# EAGLE schematic MotorControllerV7_HBridge2 (EAGLE 7.1.0)
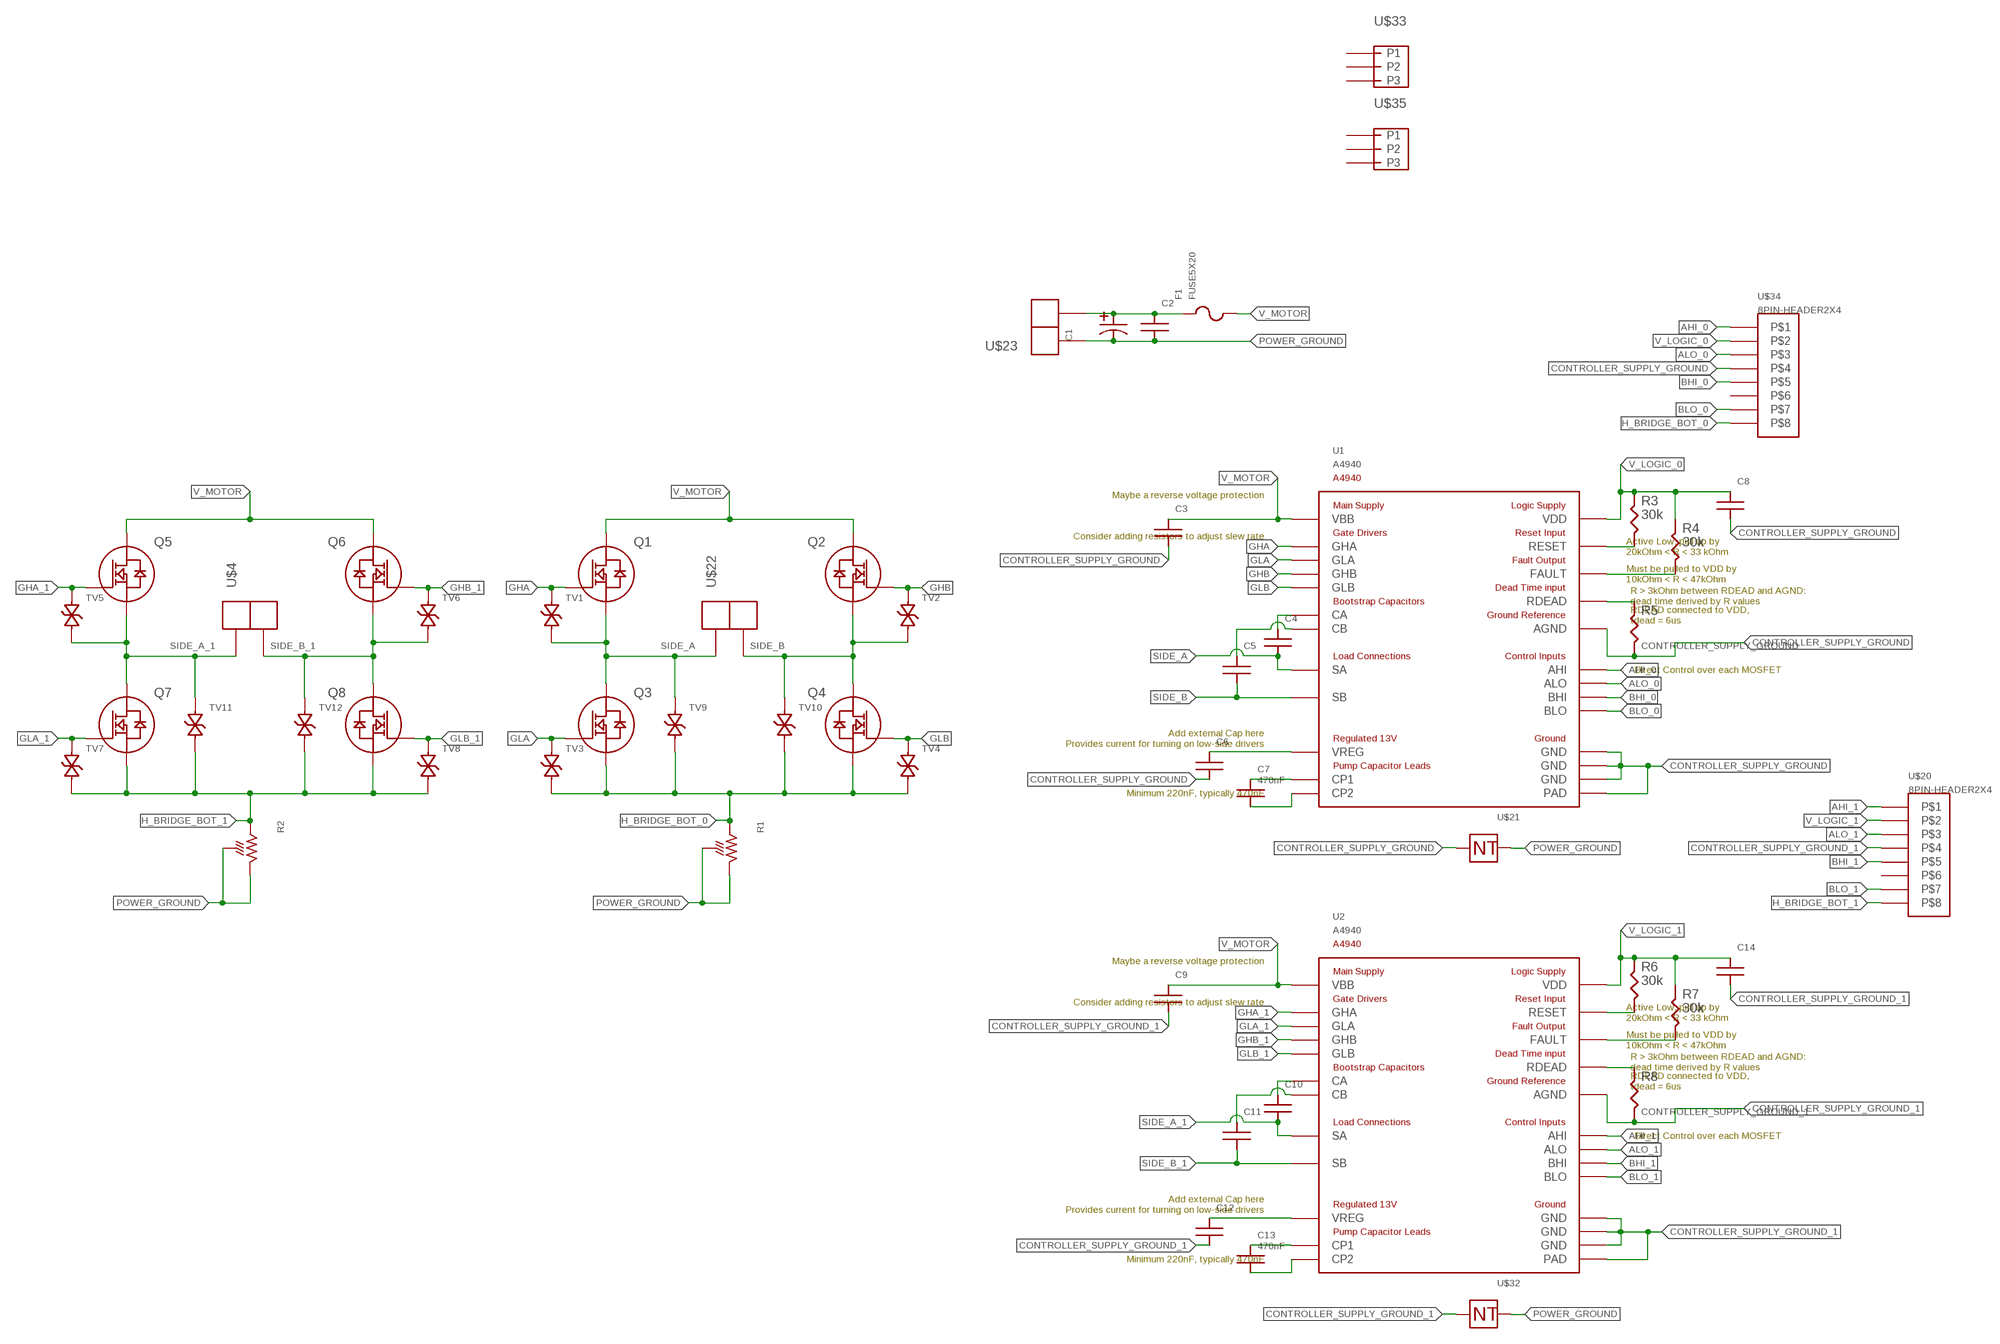
[diagram p0: schematic, sheet 1]

## Parts
C1  CAPACITORESK_H4  [ESK_H4_CAPACITOR]
C2  CAPACITOR-UNPOLARIZED0805  [0805_STACKPOLERESISTOR]
C3  CAPACITOR-UNPOLARIZED0805  [0805_STACKPOLERESISTOR]
C4  CAPACITOR-UNPOLARIZED0805  [0805_STACKPOLERESISTOR]
C5  CAPACITOR-UNPOLARIZED0805  [0805_STACKPOLERESISTOR]
C6  CAPACITOR-UNPOLARIZED0805  [0805_STACKPOLERESISTOR]
C7  470nF  CAPACITOR-UNPOLARIZED0805  [0805_STACKPOLERESISTOR]
C8  CAPACITOR-UNPOLARIZED0805  [0805_STACKPOLERESISTOR]
C9  CAPACITOR-UNPOLARIZED0805  [0805_STACKPOLERESISTOR]
C10  CAPACITOR-UNPOLARIZED0805  [0805_STACKPOLERESISTOR]
C11  CAPACITOR-UNPOLARIZED0805  [0805_STACKPOLERESISTOR]
C12  CAPACITOR-UNPOLARIZED0805  [0805_STACKPOLERESISTOR]
C13  470nF  CAPACITOR-UNPOLARIZED0805  [0805_STACKPOLERESISTOR]
C14  CAPACITOR-UNPOLARIZED0805  [0805_STACKPOLERESISTOR]
F1  FUSE5X20  [LITTLEFUSE_5X20_HOLDER]
Q1  NMOSSOT669  [SOT669]
Q2  NMOSSOT669  [SOT669]
Q3  NMOSSOT669  [SOT669]
Q4  NMOSSOT669  [SOT669]
Q5  NMOSSOT669  [SOT669]
Q6  NMOSSOT669  [SOT669]
Q7  NMOSSOT669  [SOT669]
Q8  NMOSSOT669  [SOT669]
R1  RESISTOR_HEATSUNK  [TO-252]
R2  RESISTOR_HEATSUNK  [TO-252]
R3  30k  RESISTOR  [0805_STACKPOLERESISTOR]
R4  30k  RESISTOR  [0805_STACKPOLERESISTOR]
R5  RESISTOR  [0805_STACKPOLERESISTOR]
R6  30k  RESISTOR  [0805_STACKPOLERESISTOR]
R7  30k  RESISTOR  [0805_STACKPOLERESISTOR]
R8  RESISTOR  [0805_STACKPOLERESISTOR]
TV1  TVS_BIDIRECTIONALDO-214AC  [DO-214AC]
TV2  TVS_BIDIRECTIONALDO-214AC  [DO-214AC]
TV3  TVS_BIDIRECTIONALDO-214AC  [DO-214AC]
TV4  TVS_BIDIRECTIONALDO-214AC  [DO-214AC]
TV5  TVS_BIDIRECTIONALDO-214AC  [DO-214AC]
TV6  TVS_BIDIRECTIONALDO-214AC  [DO-214AC]
TV7  TVS_BIDIRECTIONALDO-214AC  [DO-214AC]
TV8  TVS_BIDIRECTIONALDO-214AC  [DO-214AC]
TV9  TVS_BIDIRECTIONAL  [SMB]
TV10  TVS_BIDIRECTIONAL  [SMB]
TV11  TVS_BIDIRECTIONAL  [SMB]
TV12  TVS_BIDIRECTIONAL  [SMB]
U1  A4940  [LP_24-PIN_TSSOP]
U2  A4940  [LP_24-PIN_TSSOP]
U$4  2PIN-HEADERANDERSON_RIGHTANGLE  [ANDERSON_RIGHTANGLE_X2]
U$20  8PIN-HEADER2X4  [8PIN_2X4]
U$21  NET_TIE1MM  [NET_TIE]
U$22  2PIN-HEADERANDERSON_RIGHTANGLE  [ANDERSON_RIGHTANGLE_X2]
U$23  2PIN-HEADERANDERSON_RIGHTANGLE  [ANDERSON_RIGHTANGLE_X2]
U$32  NET_TIE1MM  [NET_TIE]
U$33  3PIN_HEADER  [3PIN_HEADER]
U$34  8PIN-HEADER2X4  [8PIN_2X4]
U$35  3PIN_HEADER  [3PIN_HEADER]

## Nets
AHI_0: U1.20(AHI) U$34.1
AHI_1: U2.20(AHI) U$20.1
ALO_0: U1.19(ALO) U$34.3
ALO_1: U2.19(ALO) U$20.3
BHI_0: U1.18(BHI) U$34.5
BHI_1: U2.18(BHI) U$20.5
BLO_0: U1.17(BLO) U$34.7
BLO_1: U2.17(BLO) U$20.7
CONTROLLER_SUPPLY_GROUND: C3.P$2 C6.P$2 C8.P$2 R5.P$2 U1.2(GND) U1.15(GND) U1.16(GND) U1.22(AGND) U1.PAD U$21.1 U$34.4
CONTROLLER_SUPPLY_GROUND_1: C9.P$2 C12.P$2 C14.P$2 R8.P$2 U2.2(GND) U2.15(GND) U2.16(GND) U2.22(AGND) U2.PAD U$20.4 U$32.1
GHA: Q1.4(GATE) TV1.P$2 U1.9(GHA)
GHA_1: Q5.4(GATE) TV5.P$2 U2.9(GHA)
GHB: Q2.4(GATE) TV2.P$2 U1.5(GHB)
GHB_1: Q6.4(GATE) TV6.P$2 U2.5(GHB)
GLA: Q3.4(GATE) TV3.P$2 U1.11(GLA)
GLA_1: Q7.4(GATE) TV7.P$2 U2.11(GLA)
GLB: Q4.4(GATE) TV4.P$2 U1.3(GLB)
GLB_1: Q8.4(GATE) TV8.P$2 U2.3(GLB)
H_BRIDGE_BOT_0: Q3.1(SOURCE) Q3.2(SOURCE) Q3.3(SOURCE) Q4.1(SOURCE) Q4.2(SOURCE) Q4.3(SOURCE) R1.1 TV3.P$1 TV4.P$1 TV9.1 TV10.1 U$34.8
H_BRIDGE_BOT_1: Q7.1(SOURCE) Q7.2(SOURCE) Q7.3(SOURCE) Q8.1(SOURCE) Q8.2(SOURCE) Q8.3(SOURCE) R2.1 TV7.P$1 TV8.P$1 TV11.1 TV12.1 U$20.8
N$1: R3.P$2 U1.1(RESET)
N$2: R4.P$2 U1.24(FAULT)
N$5: C7.P$1 U1.14(CP1)
N$6: C7.P$2 U1.13(CP2)
N$7: C6.P$1 U1.7(VREG)
N$8: R5.P$1 U1.23(RDEAD)
N$10: C4.P$1 U1.8(CA)
N$12: C5.P$1 U1.6(CB)
N$14: C13.P$1 U2.14(CP1)
N$15: C13.P$2 U2.13(CP2)
N$16: C12.P$1 U2.7(VREG)
N$17: C10.P$1 U2.8(CA)
N$18: C11.P$1 U2.6(CB)
N$19: R6.P$2 U2.1(RESET)
N$20: R7.P$2 U2.24(FAULT)
N$21: R8.P$1 U2.23(RDEAD)
POWER_GROUND: C1.NEGATIVE_PAD(NEGATIVE_LEAD) C2.P$2 R1.2 R1.TAB(SINK) R2.2 R2.TAB(SINK) U$21.2 U$23.P1 U$32.2
SIDE_A: C4.P$2 Q1.1(SOURCE) Q1.2(SOURCE) Q1.3(SOURCE) Q3.MB(DRAIN) TV1.P$1 TV9.2 U1.10(SA) U$22.P1
SIDE_A_1: C10.P$2 Q5.1(SOURCE) Q5.2(SOURCE) Q5.3(SOURCE) Q7.MB(DRAIN) TV5.P$1 TV11.2 U2.10(SA) U$4.P1
SIDE_B: C5.P$2 Q2.1(SOURCE) Q2.2(SOURCE) Q2.3(SOURCE) Q4.MB(DRAIN) TV2.P$1 TV10.2 U1.4(SB) U$22.P2
SIDE_B_1: C11.P$2 Q6.1(SOURCE) Q6.2(SOURCE) Q6.3(SOURCE) Q8.MB(DRAIN) TV6.P$1 TV12.2 U2.4(SB) U$4.P2
V_LOGIC_0: C8.P$1 R3.P$1 R4.P$1 U1.21(VDD) U$34.2
V_LOGIC_1: C14.P$1 R6.P$1 R7.P$1 U2.21(VDD) U$20.2
V_MOTOR: C3.P$1 C9.P$1 F1.RIGHT_1 F1.RIGHT_2 Q1.MB(DRAIN) Q2.MB(DRAIN) Q5.MB(DRAIN) Q6.MB(DRAIN) U1.12(VBB) U2.12(VBB)
V_MOTOR_UNFUSED: C1.POSITIVE_PAD(POSITIVE_LEAD) C2.P$1 F1.LEFT_1 F1.LEFT_2 U$23.P2
Unconnected: U$20.6 U$33.P1 U$33.P2 U$33.P3 U$34.6 U$35.P1 U$35.P2 U$35.P3

## Notes on the sheet
- Maybe a reverse voltage protection
- Consider adding resistors to adjust slew rate
- Maybe a reverse voltage protection
- Consider adding resistors to adjust slew rate

## Library data of the parts
C1 = 000_CustomPartsMaster:CAPACITOR
C2-C14 = 000_CustomPartsMaster:CAPACITOR-UNPOLARIZED
F1 = 000_CustomPartsMaster:FUSE
Q1-Q8 = 000_CustomPartsMaster:NMOS
R1 R2 = 000_CustomPartsMaster:RESISTOR_HEATSUNK
R3-R8 = 000_CustomPartsMaster:RESISTOR
TV1-TV12 = 000_CustomPartsMaster:TVS_BIDIRECTIONAL
U1 U2 = 000_CustomPartsMaster:A4940
U$4 U$22 U$23 = 000_CustomPartsMaster:2PIN-HEADER
U$20 U$34 = 000_CustomPartsMaster:8PIN-HEADER
U$21 U$32 = 000_CustomPartsMaster:NET_TIE
U$33 U$35 = 000_CustomPartsMaster:3PIN_HEADER